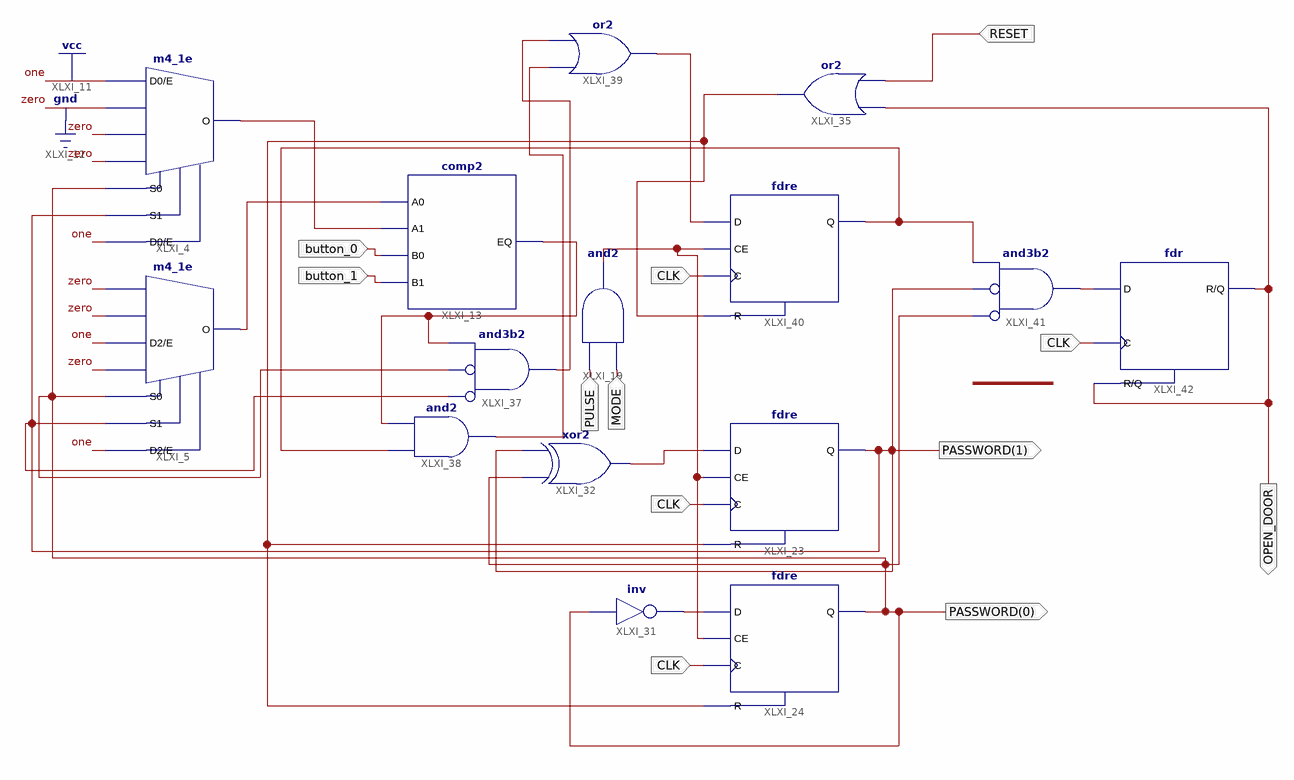
[diagram p0: schematic sheet 1]
// Xilinx ISE schematic password.sch (spartan3e) as structural Verilog: 15 symbols, 9 ports
module password (
  input  button_0,
  input  button_1,
  input  RESET,
  input  CLK,
  input  PULSE,
  input  MODE,
  output [1:0] PASSWORD,
  output OPEN_DOOR
);

  wire XLXN_17, XLXN_18, XLXN_22, XLXN_27, XLXN_58, XLXN_61, XLXN_72, XLXN_74, XLXN_76, XLXN_77, XLXN_78,
       XLXN_79;

  m4_1e XLXI_5 (.D0(1'b0), .D1(1'b0), .D2(1'b1), .D3(1'b0), .E(1'b1), .S0(PASSWORD[0]), .S1(PASSWORD[1]), .O(XLXN_18));
  m4_1e XLXI_4 (.D0(1'b1), .D1(1'b0), .D2(1'b0), .D3(1'b0), .E(1'b1), .S0(PASSWORD[0]), .S1(PASSWORD[1]), .O(XLXN_17));
  comp2 XLXI_13 (.A0(XLXN_18), .A1(XLXN_17), .B0(button_0), .B1(button_1), .EQ(XLXN_74));
  and XLXI_19 (XLXN_27, MODE, PULSE);
  fdre XLXI_23 (.C(CLK), .CE(XLXN_27), .D(XLXN_61), .R(XLXN_72), .Q(PASSWORD[1]));
  fdre XLXI_24 (.C(CLK), .CE(XLXN_27), .D(XLXN_58), .R(XLXN_72), .Q(PASSWORD[0]));
  not XLXI_31 (XLXN_58, PASSWORD[0]);
  xor XLXI_32 (XLXN_61, PASSWORD[0], PASSWORD[1]);
  or XLXI_35 (XLXN_72, RESET, OPEN_DOOR);
  and XLXI_37 (XLXN_77, ~PASSWORD[1], ~PASSWORD[0], XLXN_74);  // and3b2
  and XLXI_38 (XLXN_78, XLXN_76, XLXN_74);
  or XLXI_39 (XLXN_22, XLXN_78, XLXN_77);
  fdre XLXI_40 (.C(CLK), .CE(XLXN_27), .D(XLXN_22), .R(XLXN_72), .Q(XLXN_76));
  and XLXI_41 (XLXN_79, ~PASSWORD[0], ~PASSWORD[1], XLXN_76);  // and3b2
  fdr XLXI_42 (.C(CLK), .D(XLXN_79), .R(OPEN_DOOR), .Q(OPEN_DOOR));
endmodule
